# EasyEDA Pro project Chimera_Gen.4_Power_PCB.eprj

# Schematic Schematic1
Board Name: Board1; Create Date: 2025-08-23; Page Name: P1; Project Name: Chimera_Gen.4_Power_PCB; Schematic Name: Schematic1; Update Date: 2025-08-24; Company: 嘉立创EDA; Page Size: A4; Version: V1.0
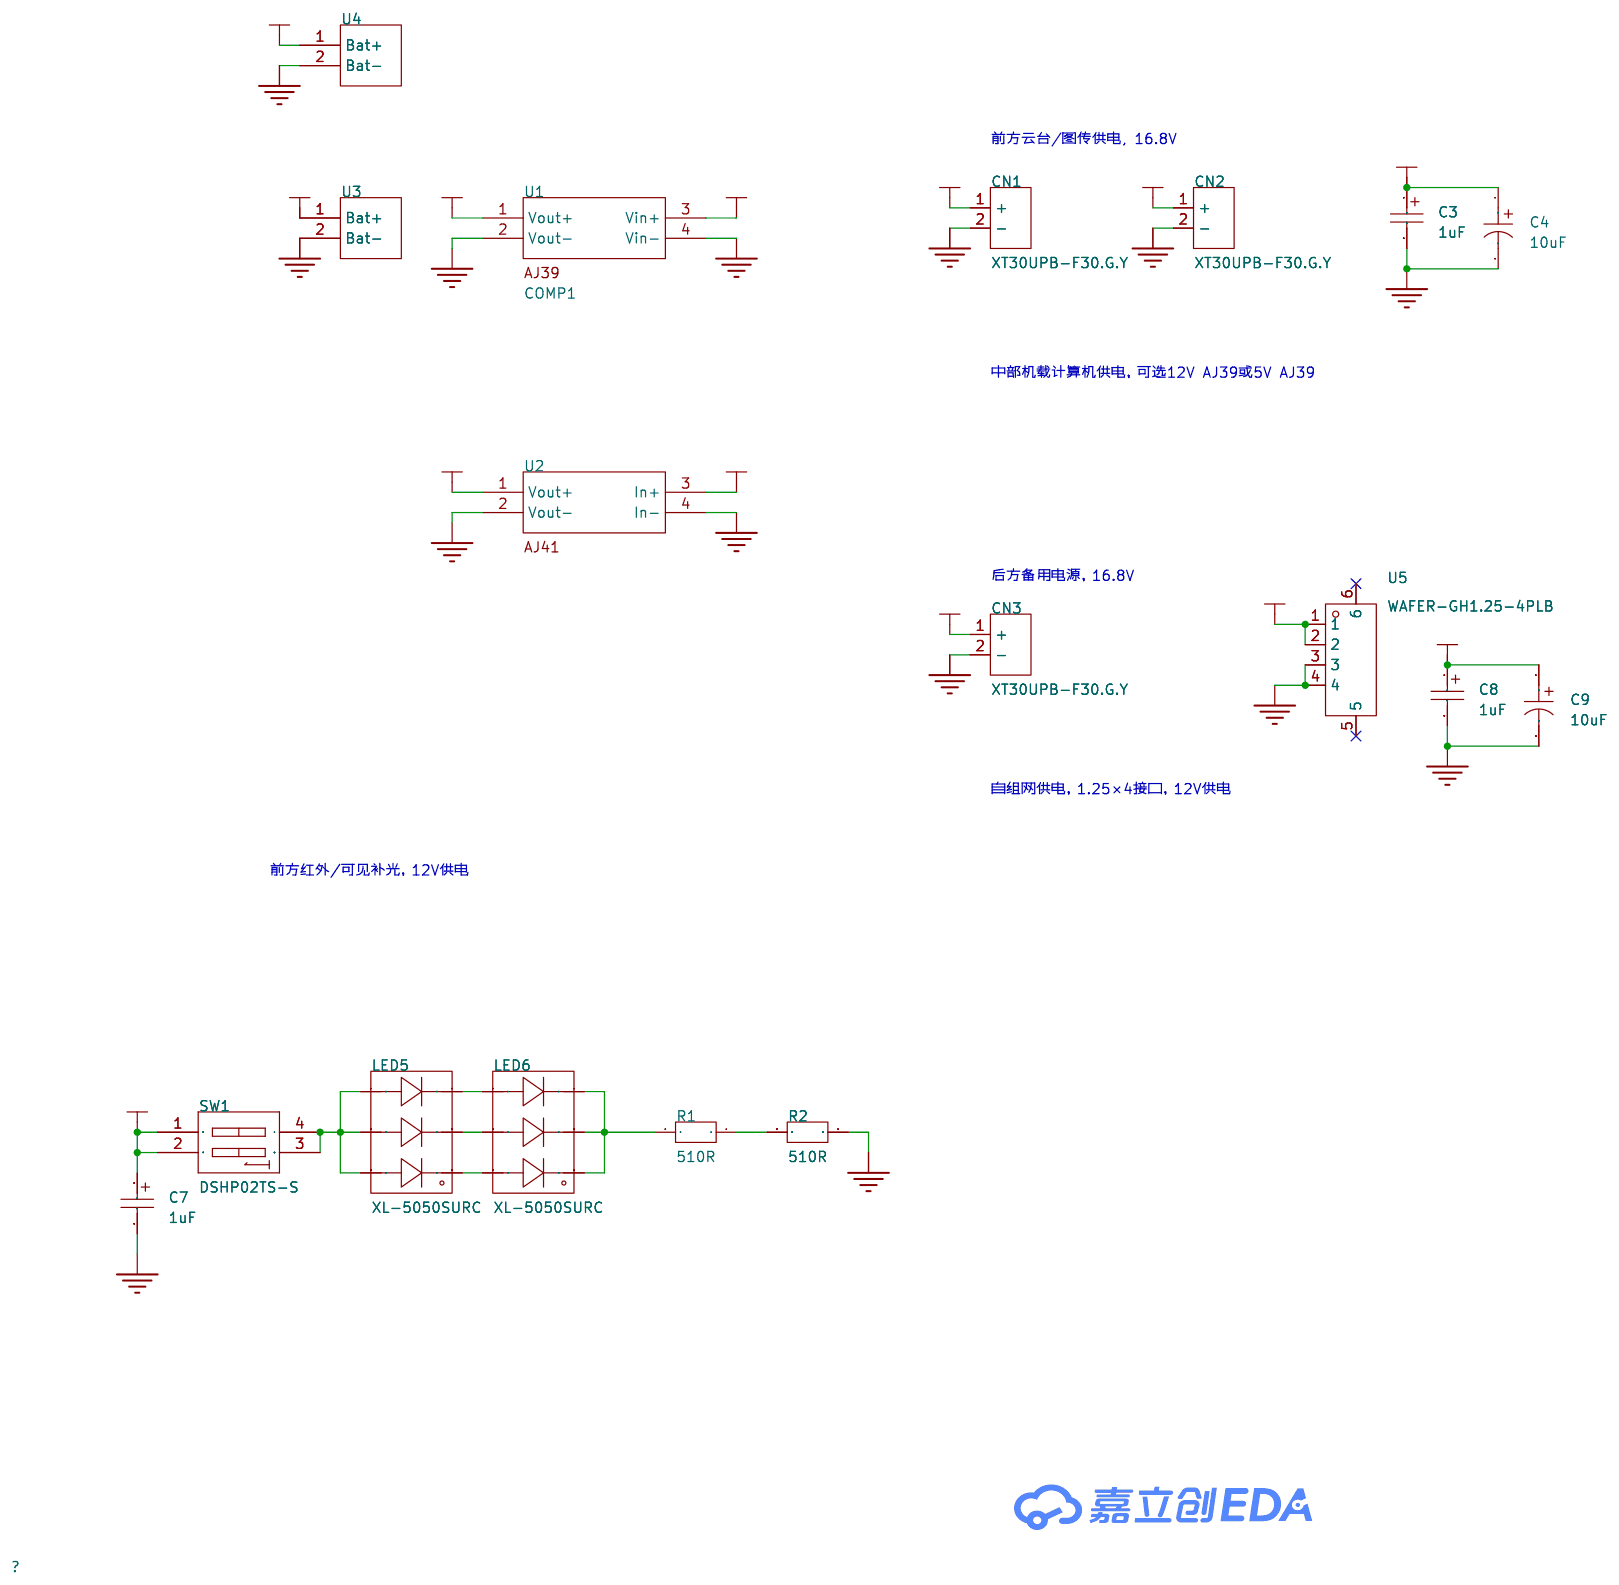
[diagram p0: schematic sheet]

## Parts
C3  1uF  [CASE-A_3216]
C4  10uF  [CAP-SMD_L3.5-W2.8]
C7  1uF  [CASE-A_3216]
C8  1uF  [CASE-A_3216]
C9  10uF  [CAP-SMD_L3.5-W2.8]
CN1  XT30UPB-F30.G.Y  [CONN-TH_XT30UPB-F]
CN2  XT30UPB-F30.G.Y  [CONN-TH_XT30UPB-F]
CN3  XT30UPB-F30.G.Y  [CONN-TH_XT30UPB-F]
LED5  XL-5050SURC  [LED-ARRAY-SMD_6P-L5.0-W5.0-TL-RD-2]
LED6  XL-5050SURC  [LED-ARRAY-SMD_6P-L5.0-W5.0-TL-RD-2]
R1  510R  [R1206]
R2  510R  [R1206]
SW1  DSHP02TS-S  [SW-SMD_DSHP02TS-S]
U1  COMP1  [AJ39稳压模块]
U2  -  [AJ41稳压模块]
U3  -  [计算机供电焊盘-配合AJ39]
U4  -  [电池输入焊盘]
U5  WAFER-GH1.25-4PLB  [CONN-SMD_4P-P1.25_XUNPU_WAFER-GH1.25-4PLB]

## Library data of the parts
C3 C7 C8 = TAJA105K025RNJ: LCSC Part Name: 1uF ±10% 25V; Supplier Part: C7175; Manufacturer: Kyocera AVX; Supplier Footprint: CASE-A-3216; JLCPCB Part Class: 扩展库; Datasheet: https://atta.szlcsc.com/upload/public/pdf/source/20160107/1457707750344.pdf; Supplier: LCSC; Tolerance: ±10%; Rated Voltage: 25V; Equivalent Series Resistance(ESR): 8Ω@100kHz; Operating Temperature: -55℃~+125℃
C4 C9 = CA45-B-25V-10μF-K: LCSC Part Name: 10uF ±10% 25V; Supplier Part: C503897; Manufacturer: TORCH(火炬); Supplier Footprint: CASE-B-3528-19(mm); JLCPCB Part Class: 扩展库; Datasheet: https://atta.szlcsc.com/upload/public/pdf/source/20200527/C503897_C8E91496D831471D13744C8C1947B139.pdf; Supplier: LCSC; Tolerance: ±10%; Voltage Rating: 25V; Equivalent Series Resistance(ESR): 2.5Ω@100kHz; Operating Temperature: -55℃~+125℃
CN1-CN3 = XT30UPB-F30.G.Y: LCSC Part Name: AMASS(艾迈斯)直立焊板式连接器XT30UPB30-F.G.*; Supplier Part: C108769; Manufacturer: AMASS(艾迈斯); JLCPCB Part Class: 扩展库; Datasheet: https://item.szlcsc.com/datasheet/XT30UPB-F30.G.Y/109989.html; Supplier: LCSC; Type: 航模插头; Colour: 黄色; RatedVoltage: DC 500V; InterfaceType: 母头; MetalMaterial: 镀金; InsulationMaterial: PA; RatedCurrent: 15A; contact resistance: 0.65mΩ
LED5 LED6 = XL-5050SURC: Supplier Part: C2843864; Manufacturer: XINGLIGHT(成兴光); Supplier Footprint: SMD5050; JLCPCB Part Class: 扩展库; Datasheet: https://item.szlcsc.com/datasheet/XL-5050SURC/3033165.html; Supplier: LCSC; Illumination Color: 红色; Voltage - Forward(Vf): 2.4V; Power(Watts): 200mW; Forward Current: 60mA; Wavelength - Dominant: 620nm~630nm; Peak Wavelength: 625nm; Lens Color: 无色透明透镜; Luminous Intensity: 2200mcd; Viewing Angle: 120°; Mounting Sytle: 正贴; Operating Temperature: -20℃~+85℃
R1 R2 = RE1206F1R000: LCSC Part Name: 0mΩ 1W 1206 ±1%; Supplier Part: C46961765; Manufacturer: 捷而瑞; Supplier Footprint: 1206; JLCPCB Part Class: 扩展库; Datasheet: https://atta.szlcsc.com/upload/public/pdf/source/20250325/401775B85EF7B3A580BC34DFED100CB2.pdf; Supplier: LCSC; Type: 采样电阻; Tolerance: ±1%; Power(Watts): 1W
SW1 = DSHP02TS-S: LCSC Part Name: 间距1.27mm 平拨,凹槽式 2位拨码开关; Supplier Part: C319052; Manufacturer: XKB Connectivity(中国星坤); Supplier Footprint: SMD-4P,4.1x5.4mm; JLCPCB Part Class: 扩展库; Datasheet: https://atta.szlcsc.com/upload/public/pdf/source/20211009/11BE85C99D2C85B0991AF4F9D6EB8BDE.pdf; Supplier: LCSC; Type: 平拨,凹槽式; Circuit: 单刀单掷; Number of Positions: 2位; Pin Style: 鸥翼型; Lead Pitch: 1.27mm; Current Rating: 25mA; Voltage Rating: 24V; Operating Temperature: -20℃~+70℃; Operating Life: 3千次; Color: 黑色
U1 = AJ39稳压模块
U2 = AJ41稳压模块
U3 U4 = 输入输出焊盘
U5 = WAFER-GH1.25-4PLB: LCSC Part Name: 1x4P 间距:1.25mm 立贴 系列:GH; Supplier Part: C3029370; Manufacturer: XUNPU(讯普); Supplier Footprint: SMD,P=1.25mm; JLCPCB Part Class: 扩展库; Datasheet: https://item.szlcsc.com/datasheet/WAFER-GH1.25-4PLB/3561382.html; Supplier: LCSC; Pins Structure: 1x4P; Pitch: 1.25mm; Mounting Type: 立贴; Reference Series: GH; Number of Pins: 4P; Number of Rows: 1; Number of PINs Per Row: 4; Current Rating: 1A; Contact Material: 黄铜; Operating Temperature: -25℃~+85℃; Voltage Rating: 125V; Plastic Material: LCP; Supplementary Features: 辅助焊脚; Color: 米色; Z-Height of the Board: 4.2mm; X-Length of Bottom Edge on Board (Spacing Line): 8.25mm; Y-Width of Bottom Edge on Board: 4.95mm

## Nets
5V/12V: U1.1(Vout+) U3.1(Bat+)
12V: C7.1 SW1.1 SW1.2 U2.1(Vout+) U5.1 U5.2
GND: C3.2 C4.2 C7.2 C8.2 C9.2 CN1.2(-) CN2.2(-) CN3.2(-) R2.1 U1.2(Vout-) U1.4(Vin-) U2.2(Vout-) U2.4(In-) U3.2(Bat-) U4.2(Bat-) U5.3 U5.4
VBAT: C3.1 C4.1 C8.1 C9.1 CN1.1(+) CN2.1(+) CN3.1(+) U1.3(Vin+) U2.3(In+) U4.1(Bat+)
$1N2538: LED5.6(K) LED6.3(A)
$1N2540: LED5.5(K) LED6.2(A)
$1N2542: LED5.4(K) LED6.1(A)
$1N2544: R1.1 R2.2
$1N2548: LED5.1(A) LED5.2(A) LED5.3(A) SW1.3 SW1.4
$1N2598: LED6.4(K) LED6.5(K) LED6.6(K) R1.2

Not connected (* = marked no-connect by the designer): U5 5* 6*

## Notes on the sheet
- 前方云台/图传供电, 16.8V
- 中部机载计算机供电，可选12V AJ39或5V AJ39
- 后方备用电源，16.8V
- 自组网供电，1.25×4接口，12V供电
- 前方红外/可见补光，12V供电

# Board PCB1
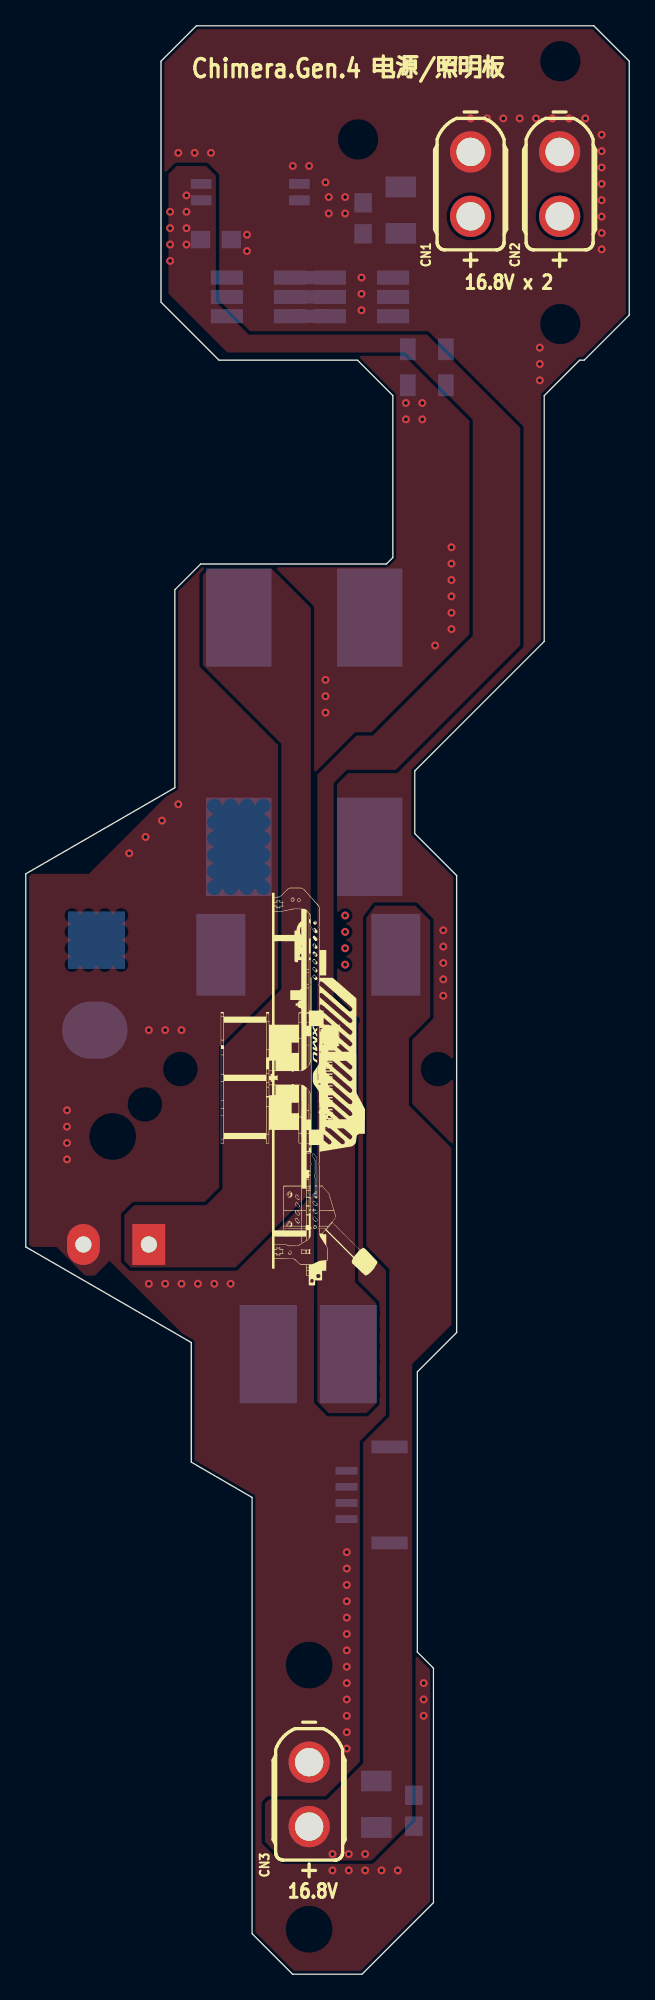
[diagram p1: board, top side]
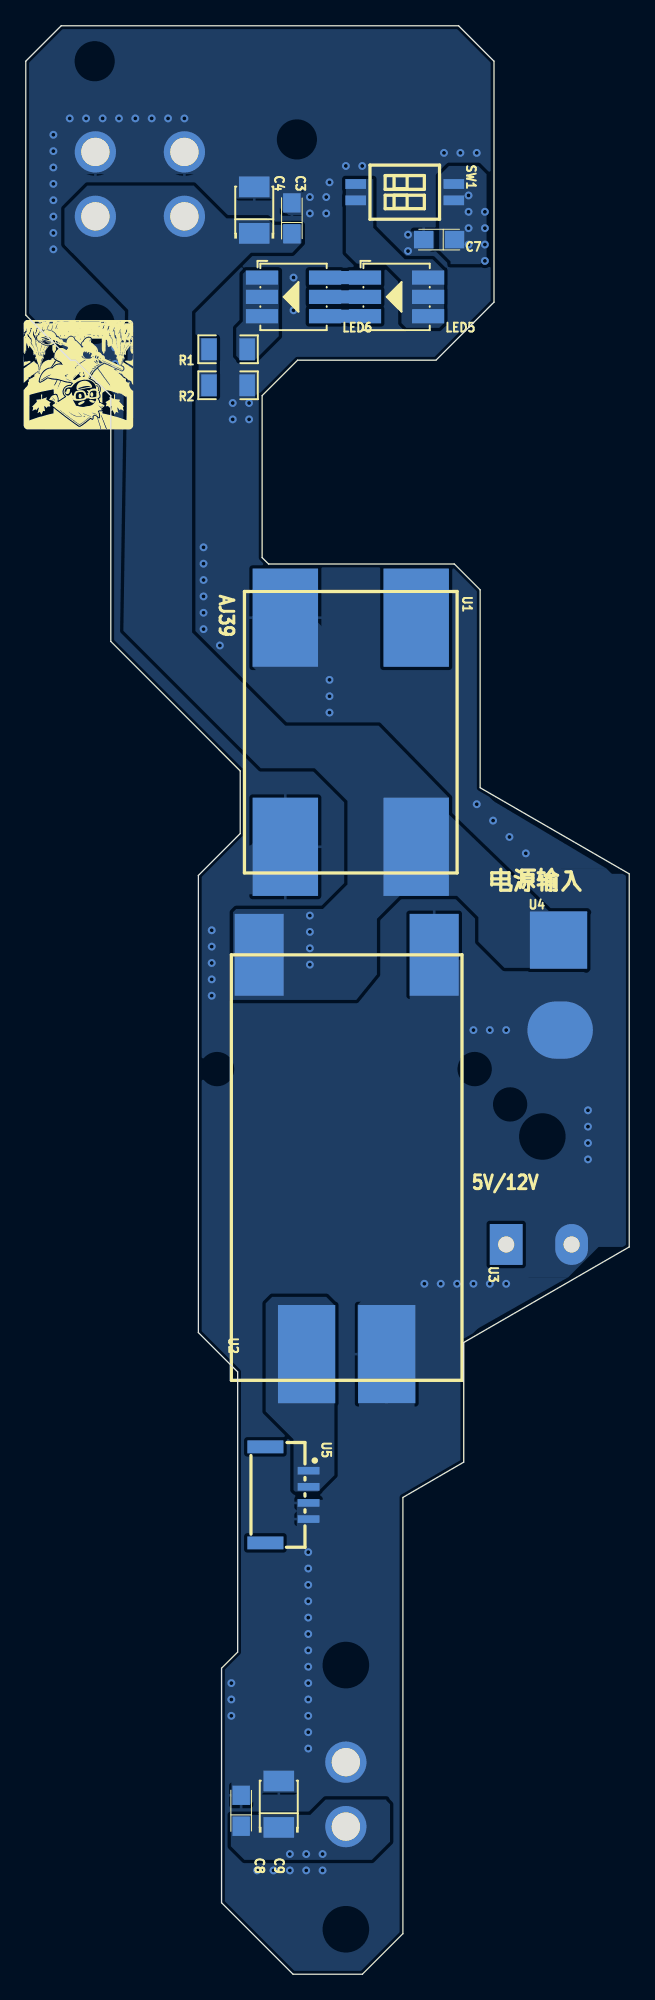
[diagram p2: board, bottom side, seen from below]

Outline 46.85 x 151.2 mm; copper layers: Top Layer, Bottom Layer. Coordinates in mm from the lower left corner of the outline.
Outline path: 0,85.39 0,56.44 12.85,49.02 12.85,39.74 17.57,37 17.57,3.15 20.72,0 26.1,0 31.65,5.55 31.65,23.75 30.4,25 30.4,46.74 33.45,49.79 33.45,85.26 30.2,88.51 30.2,93.38 40.25,103.43 40.25,122.5 43,125.25 43.35,125.25 46.85,128.75 46.85,148.45 44.1,151.2 13.25,151.2 10.5,148.45 10.5,129.75 15,125.25 25.75,125.25 28.5,122.5 28.5,109.93 28,109.43 13.57,109.43 11.57,107.43 11.57,92.07 0,85.39
Stack: Top Layer 0.035mm / Dielectric1 1.51mm FR4 er 4.5 / Bottom Layer 0.035mm

## Design rules (mm)
template: 自定义配置
spacing copperThickness1oz (default): track to track 0.102, other pairs 0.152 to 0.3
spacing copperThickness2oz: track to track 0.203, other pairs 0.152 to 0.3
track width copperThickness1oz (default): min 0.127, default 1.016, max 5.08
track width copperThickness2oz: min 0.203, default 1.016, max 5.08
differential pair differentialPair (default): width min 0.127, default 0.254, max 2.54; gap min 0.152, default 0.152
via viaSize (default): diameter min 0.5, default 0.61, max 10; hole min 0.3, default 0.305, max 6.3

## Placement (name value [footprint] x y rotation side)
C3  1uF  [CASE-A_3216]  26.19 136.26 90 bottom
C4  10uF  [CAP-SMD_L3.5-W2.8]  29.11 136.89 270 bottom
C7  1uF  [CASE-A_3216]  14.76 134.61 0 bottom
C8  1uF  [CASE-A_3216]  30.13 12.69 90 bottom
C9  10uF  [CAP-SMD_L3.5-W2.8]  27.21 13.19 270 bottom
CN1  XT30UPB-F30.G.Y  [CONN-TH_XT30UPB-F]  34.53 138.91 90 top
CN2  XT30UPB-F30.G.Y  [CONN-TH_XT30UPB-F]  41.45 138.91 90 top
CN3  XT30UPB-F30.G.Y  [CONN-TH_XT30UPB-F]  22 13.96 90 top
LED5  XL-5050SURC  [LED-ARRAY-SMD_6P-L5.0-W5.0-TL-RD-2]  18.06 130.16 0 bottom
LED6  XL-5050SURC  [LED-ARRAY-SMD_6P-L5.0-W5.0-TL-RD-2]  26.06 130.16 0 bottom
R1  510R  [R1206]  31.14 126.1 180 bottom
R2  510R  [R1206]  31.14 123.3 0 bottom
SW1  DSHP02TS-S  [SW-SMD_DSHP02TS-S]  17.43 138.29 270 bottom
U1  COMP1  [AJ39稳压模块]  26.7 105.27 270 bottom
U2  -  [AJ41稳压模块]  16.16 48.12 90 bottom
U3  -  [计算机供电焊盘-配合AJ39]  4.47 56.63 90 bottom
U4  -  [电池输入焊盘]  5.49 73.27 180 bottom
U5  WAFER-GH1.25-4PLB  [CONN-SMD_4P-P1.25_XUNPU_WAFER-GH1.25-4PLB]  26.57 37.2 270 bottom

## Footprints (pads in the part's own frame, mm; a bottom-side part is the same pattern mirrored in y, then rotated)
AJ39稳压模块
  rect 7.62x5.08 smd: 1(0,10.16) 2(0,0) 3(17.78,10.16) 4(17.78,0)
AJ41稳压模块
  rect 7.62x4.445 smd: 1(0,8.89) 2(0,2.668)
  rect 6.35x3.81 smd: 3(30.988,12.573) 4(30.988,-1.016)
CAP-SMD_L3.5-W2.8
  rect 1.607x2.376 smd: 1(1.804,0) 2(-1.804,0)
CASE-A_3216
  rect 1.5x1.359 smd: 1(-1.2,0) 2(1.2,0)
CONN-SMD_4P-P1.25_XUNPU_WAFER-GH1.25-4PLB
  rect 0.6x1.7 smd: 1(-1.875,1.675) 2(-0.625,1.675) 3(0.625,1.675) 4(1.875,1.675)
  rect 1x2.8 smd: 5(-3.725,-1.675) 6(3.725,-1.675)
CONN-TH_XT30UPB-F
  round 3.2 hole 2.2: 1(-2.5,0) 2(2.5,0)
LED-ARRAY-SMD_6P-L5.0-W5.0-TL-RD-2
  rect 2.5x1.1 smd: 1(-2.45,1.5) 2(-2.45,0) 3(-2.45,-1.5) 4(2.45,1.5) 5(2.45,0) 6(2.45,-1.5)
R1206
  rect 1.208x1.701 smd: 1(-1.479,0) 2(1.479,0)
SW-SMD_DSHP02TS-S
  rect 0.762x1.6 smd: 1(0.635,3.81) 2(-0.635,3.81) 3(-0.635,-3.81) 4(0.635,-3.81)
电池输入焊盘
  rect 4.445x4.445 smd: 1(0,6.985)
  oval 5.08x4.445 smd: 2(0.127,0)
计算机供电焊盘-配合AJ39
  rect 3.175x2.54 hole 1.25: 1(0,5.08)
  oval 3.175x2.54 hole 1.25: 2(0,0)

## Nets
As in the schematic.

Pads without a net: U5 5 6

## Via types
v1: diameter 0.61, hole 0.305, Top Layer to Bottom Layer, 106 vias

## Routing (per net, layer and track width the routed paths; a pad name or vN(x,y) marks a point on that pad's centre or on a via; arc(x,y) is an arc through that point)
12V:
  vias: v1(11.21,136.76) v1(11.21,135.5) v1(11.21,134.22) v1(11.21,132.95) v1(12.47,138.03) v1(12.47,136.76) v1(12.47,135.5) v1(12.47,134.22)
GND:
  vias: v1(3.2,67.04) v1(3.2,65.77) v1(3.2,64.5) v1(3.2,63.23) v1(8.03,86.98) v1(9.3,88.25) v1(9.55,73.27) v1(9.55,53.58) v1(10.57,89.52) v1(10.82,73.27) v1(10.82,53.58) v1(11.84,141.34) v1(11.84,90.79) v1(12.09,73.27) v1(12.09,53.58) v1(13.11,141.34) v1(13.36,53.58) v1(14.38,141.34) v1(14.63,53.58) v1(15.9,53.58) v1(17.17,134.99) v1(17.17,133.72) v1(20.73,140.32) v1(22,140.32) v1(23.27,139.05) v1(23.27,100.44) v1(23.27,99.17) v1(23.27,97.9) v1(23.52,137.91) v1(23.52,136.64) v1(23.81,8.06) v1(24.79,137.91) v1(24.79,136.64) v1(24.92,32.75) v1(24.92,31.48) v1(24.92,30.21) v1(24.92,28.94) v1(24.92,27.67) v1(24.92,26.4) v1(24.92,25.13) v1(24.92,23.86) v1(24.92,22.59) v1(24.92,21.32) v1(24.92,20.05) v1(24.92,18.78) v1(24.92,17.51) v1(25.08,8.06) v1(26.06,131.66) v1(26.06,130.39) v1(26.06,129.12) v1(26.35,8.06) v1(27.62,8.06) v1(28.89,8.06) v1(29.51,121.93) v1(29.51,120.66) v1(30.78,121.93) v1(30.78,120.66) v1(30.89,22.59) v1(30.89,21.32) v1(30.89,20.05) v1(31.78,103.11) v1(32.41,81.01) v1(32.41,79.74) v1(32.41,78.47) v1(32.41,77.2) v1(32.41,75.93) v1(33.05,110.73) v1(33.05,109.46) v1(33.05,108.19) v1(33.05,106.92) v1(33.05,105.65) v1(33.05,104.38) v1(34.53,144.01) v1(35.8,144.01) v1(37.07,144.01) v1(38.34,144.01) v1(39.61,144.01) v1(39.91,126.22) v1(39.91,124.95) v1(39.91,123.68) v1(40.88,144.01) v1(42.17,144.01) v1(43.44,144.01) v1(44.71,142.74) v1(44.71,141.47) v1(44.71,140.2) v1(44.71,138.93) v1(44.71,137.66) v1(44.71,136.39) v1(44.71,135.12) v1(44.71,133.85)
VBAT:
  vias: v1(23.81,9.33) v1(24.79,82.16) v1(24.79,80.89) v1(24.79,79.61) v1(24.79,78.34) v1(25.08,9.33) v1(26.35,9.33)
$1N2538: length 3.1
  Bottom Layer w1.016: LED5.6 LED6.3
$1N2540: length 3.1
  Bottom Layer w1.016: LED5.5 LED6.2
$1N2542: length 3.1
  Bottom Layer w1.016: LED5.4 LED6.1

## Copper pours and planes (outline as drawn; the poured copper is in the pictures)
5V/12V on Top Layer: 7.65,109.08 22.13,109.08 22.13,54.85 7.65,54.85
12V on Top Layer: 11.08,140.32 38.38,140.32 38.38,43.55 11.08,43.55
12V on Bottom Layer: 11.08,140.32 14.76,140.32 14.76,132.7 11.08,132.7
12V on Bottom Layer: 22.89,52.56 28.22,52.56 28.22,37.45 22.89,37.45
GND on Top Layer: 13.25,151.2 10.5,148.45 10.5,129.75 15,125.25 25.77,125.25 28.5,122.52 28.5,109.93 28,109.43 13.57,109.43 11.57,107.43 11.57,92.07 4.89,85.39 0,85.39 0,56.44 5.43,56.44 12.85,49.02 12.85,39.74 15.59,37 17.57,37 17.57,3.15 20.72,0 20.72,-0.01 20.73,0 26.1,0 31.65,5.55 31.65,23.75 30.4,25 30.4,46.74 33.45,49.79 33.45,85.26 30.2,88.51 30.2,93.38 40.25,103.43 40.25,122.5 43,125.25 43.35,125.25 46.85,128.75 46.85,148.45 44.1,151.2
GND on Top Layer: 0.41,59.35 6.51,59.35 6.51,54.22 0.41,54.22
GND on Top Layer: 22.76,124.19 33.94,124.19 33.94,101.32 22.76,101.32
GND on Top Layer: 15.14,138.29 26.95,138.29 26.95,133.59 15.14,133.59
GND on Top Layer: 32.16,143.62 43.84,143.62 43.84,139.31 32.16,139.31
GND on Top Layer: 19.74,18.53 24.34,18.53 24.34,14.34 19.74,14.34
GND on Bottom Layer: 8.03,78.73 17.05,78.73 17.05,70.47 8.03,70.47
GND on Bottom Layer: 4.73,54.09 13.24,54.09 13.24,49.26 4.73,49.26
GND on Bottom Layer: 0.54,105.14 29.24,105.14 29.24,70.47 0.54,70.47
GND on Bottom Layer: 9.94,87.87 32.79,87.87 32.79,72.5 9.94,72.5
GND on Bottom Layer: 25.43,143.5 43.72,143.5 43.72,136.64 25.43,136.64
GND on Bottom Layer: 15.14,135.24 18.06,135.24 18.06,133.59 15.14,133.59
GND on Bottom Layer: 0.54,72.62 21.11,72.62 21.11,46.09 0.54,46.09
GND on Bottom Layer: 22.76,33.13 25.3,33.13 25.3,26.01 22.76,26.01
GND on Bottom Layer: 16.67,44.31 25.81,44.31 25.81,33.13 16.67,33.13
GND on Bottom Layer: 13.25,151.2 10.5,148.45 10.5,129.75 15,125.25 25.77,125.25 28.5,122.52 28.5,109.93 28,109.43 13.57,109.43 11.57,107.43 11.57,92.07 4.89,85.39 0,85.39 0,56.44 5.43,56.44 12.85,49.02 12.85,39.74 15.59,37 17.57,37 17.57,3.15 20.72,0 20.72,-0.01 20.73,0 26.1,0 31.65,5.55 31.65,23.75 30.4,25 30.4,46.74 33.45,49.79 33.45,85.26 30.2,88.51 30.2,93.38 40.25,103.43 40.25,122.5 43,125.25 43.35,125.25 46.85,128.75 46.85,148.45 44.1,151.2
GND on Bottom Layer: 22.76,138.29 30.51,138.29 30.51,122.41 22.76,122.41
GND on Bottom Layer: 1.82,92.19 12.47,92.19 12.47,85.84 1.82,85.84
GND on Bottom Layer: 23.27,138.29 26.93,138.29 26.93,136.51 23.27,136.51
GND on Bottom Layer: 19.59,33.13 30.89,33.13 30.89,13.15 19.59,13.15
GND on Bottom Layer: 29.03,124.41 31.91,124.41 31.91,120.35 29.03,120.35
VBAT on Top Layer: 18.57,82.92 33.05,82.92 33.05,8.82 18.57,8.82
VBAT on Bottom Layer: 14,134.22 43.82,134.22 43.82,88.5 14,88.5
VBAT on Bottom Layer: 25.43,138.8 43.84,138.8 43.84,133.59 25.43,133.59
VBAT on Bottom Layer: 3.2,91.3 19.08,91.3 19.08,77.96 3.2,77.96
VBAT on Bottom Layer: 18.57,13.56 30.93,13.56 30.93,8.88 18.57,8.88
VBAT on Bottom Layer: 14,91.3 30.76,91.3 30.76,75.61 14,75.61
$1N2544 on Bottom Layer: 32.03,126.99 33.43,126.99 33.43,122.41 32.03,122.41
$1N2548 on Bottom Layer: 14.38,139.31 22,139.31 22,127.76 14.38,127.76
$1N2598 on Bottom Layer: 27.21,132.19 30.51,132.19 30.51,125.21 27.21,125.21

## Text on the board
Bottom Silkscreen Layer: 5V/12V | AJ39 | 电源输入
Top Silkscreen Layer: 16.8V | 16.8V x 2 | Chimera.Gen.4 电源/照明板
